# EAGLE schematic v1.9 (EAGLE 9.6.2)
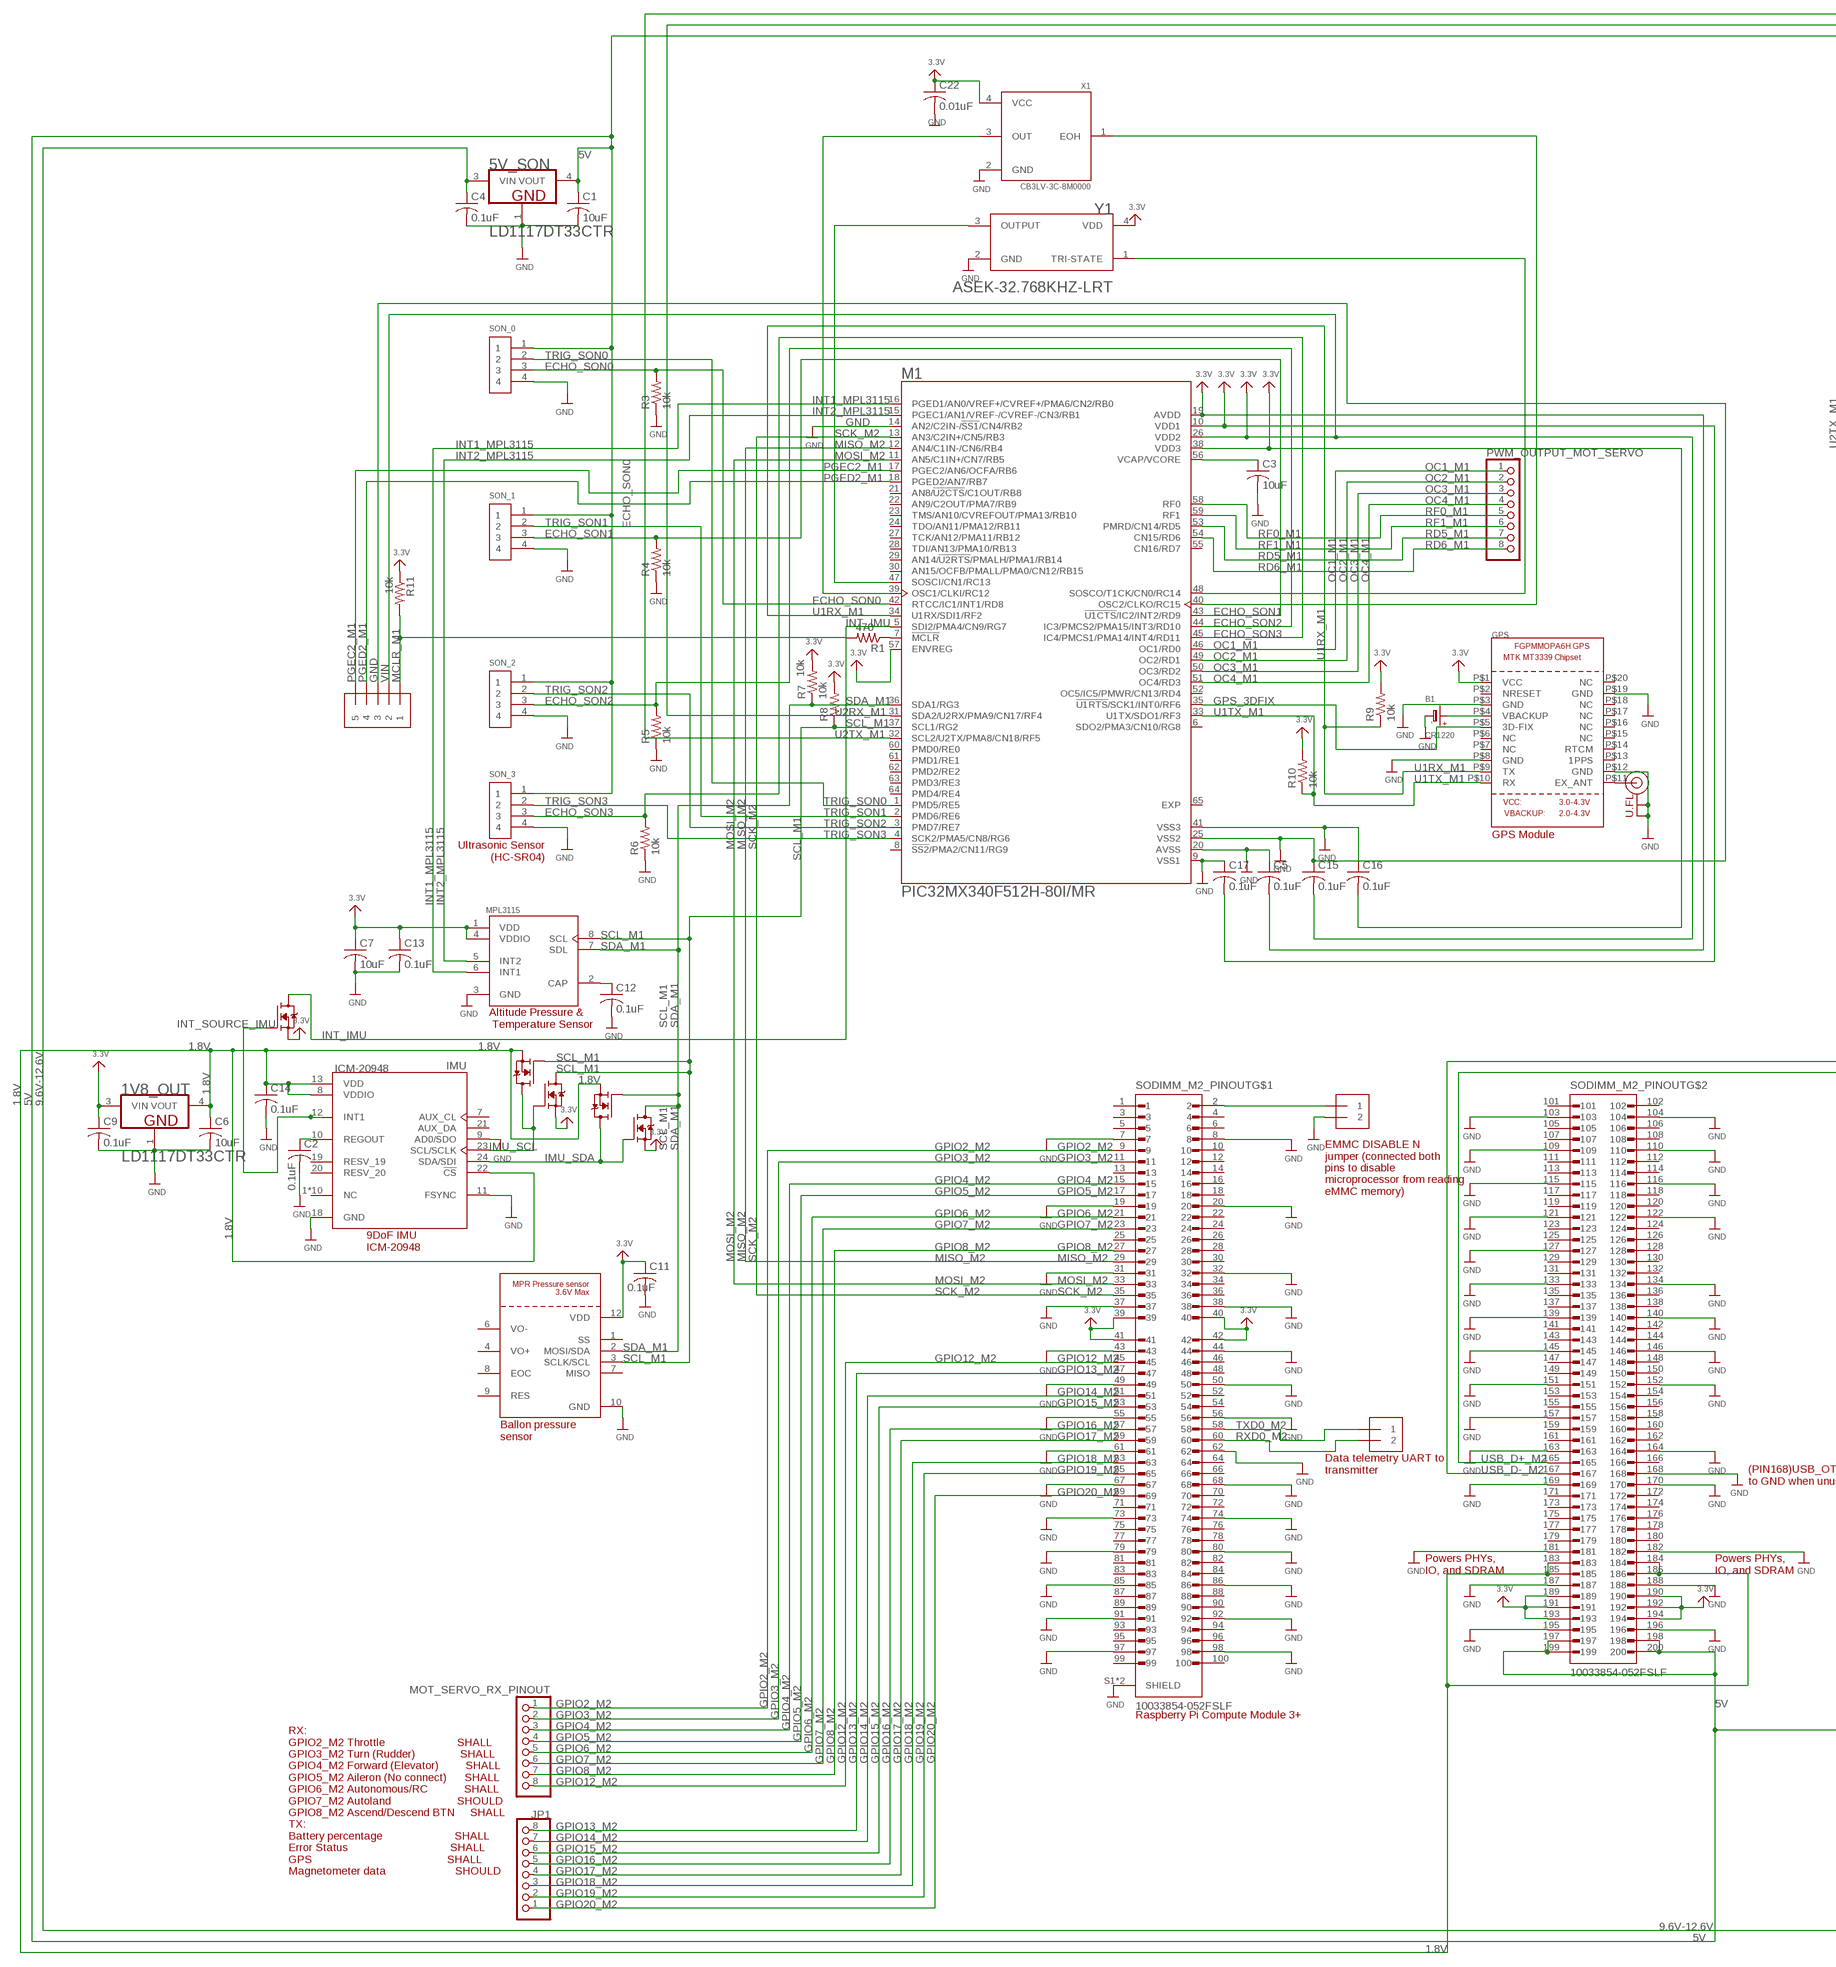
[diagram p0: schematic, sheet 1, part 1 of 2]
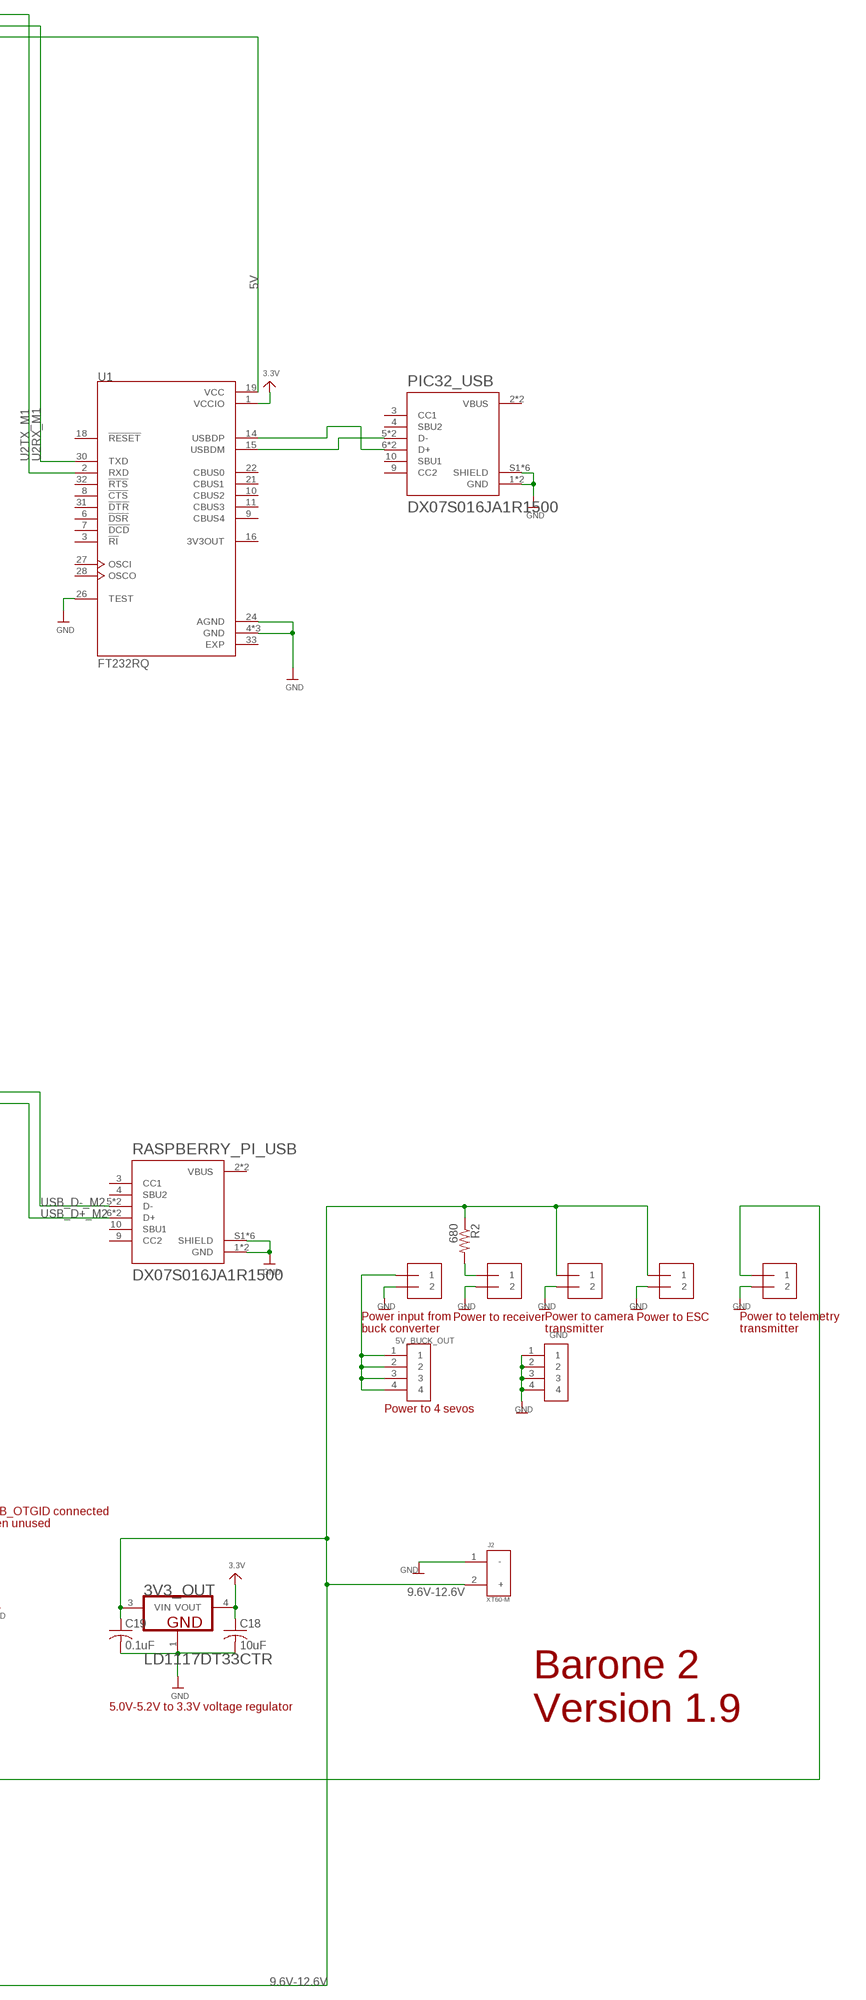
[diagram p1: schematic, sheet 1, part 2 of 2]

## Parts
1V8_OUT  STMICROELECTRONICS_LD1117DT33CTRSTMICROELECTRONICS_LD1117DT33CTR_0_2  [STMICROELECTRONICS_LD1117DT33CTR_2]
3V3_OUT  STMICROELECTRONICS_LD1117DT33CTRSTMICROELECTRONICS_LD1117DT33CTR_0_2  [STMICROELECTRONICS_LD1117DT33CTR_2]
5V_BUCK_IN  1X2-3.5MM  [1X2-3.5MM]
5V_BUCK_OUT  1X4-BIG  [1X04-BIG]
5V_SON  STMICROELECTRONICS_LD1117DT33CTRSTMICROELECTRONICS_LD1117DT50CTR_0_2  STMICROELECTRONICS_LD1117DT33CTRSTMICROELECTRONICS_LD1117DT33CTR_0_2  [STMICROELECTRONICS_LD1117DT33CTR_2]
B1  CR1220  BATTERYCR1220_SMT  [CR1220]
C1  10uF  C-USC0805  [C0805]
C2  0.1uF  C-USC0805  [C0805]
C3  10uF  C-USC0805  [C0805]
C4  0.1uF  C-USC0805  [C0805]
C5  0.1uF  C-USC0805  [C0805]
C6  10uF  C-USC0805  [C0805]
C7  10uF  C-USC0805  [C0805]
C9  0.1uF  C-USC0805  [C0805]
C11  0.1uF  C-USC0805  [C0805]
C12  0.1uF  C-USC0805  [C0805]
C13  0.1uF  C-USC0805  [C0805]
C14  0.1uF  C-USC0805  [C0805]
C15  0.1uF  C-USC0805  [C0805]
C16  0.1uF  C-USC0805  [C0805]
C17  0.1uF  C-USC0805  [C0805]
C18  10uF  C-USC0805  [C0805]
C19  0.1uF  C-USC0805  [C0805]
C22  0.01uF  C-USC0805  [C0805]
CAMERA_POWER  1X2-3.5MM  [1X2-3.5MM]
EMMC_DISABLE_N  1X2-3.5MM  [1X2-3.5MM]
ESC_POWER  1X2-3.5MM  [1X2-3.5MM]
GND  1X4-BIG  [1X04-BIG]
GPS  GPS_FGPMMOPA6H  [FGPMMOPA6H]
ICSP  1X5  [1X05-3.5MM]
IMU  ICM-20948  [QFN40P300X300X105-24N]
INT_LLC_IMU  BSS138  [SOT95P240X111-3N]
J2  XT60-M  [AMASS_XT60-M]
JP1  PINHD-1X8CLEANBIG  [1X08-CLEANBIG]
M1  PIC32MX340F512H-80I/MR  [QFN50P900X900X100-65N]
MOT_SERVO_RX_PINOUT  PINHD-1X8CLEANBIG  [1X08-CLEANBIG]
MPL3115  MPL3115A2  [PSON125P300X500X120-8N]
MPR  MPR_SERIES_I2C_PRESSURE  [MPR_SERIES_I2C_PRESSURE]
PIC32_USB  DX07S016JA1R1500  [JAE_DX07S016JA1R1500]
PWM_OUTPUT_MOT_SERVO  PINHD-1X8CLEANBIG  [1X08-CLEANBIG]
R1  470  R-US_R0805W  [R0805W]
R2  680  R-US_R0805W  [R0805W]
R3  10k  R-US_R0805W  [R0805W]
R4  10k  R-US_R0805W  [R0805W]
R5  10k  R-US_R0805W  [R0805W]
R6  10k  R-US_R0805W  [R0805W]
R7  10k  R-US_R0805W  [R0805W]
R8  10k  R-US_R0805W  [R0805W]
R9  10k  R-US_R0805W  [R0805W]
R10  10k  R-US_R0805W  [R0805W]
R11  10k  R-US_R0805W  [R0805W]
RASPBERRY_PI_USB  DX07S016JA1R1500  [JAE_DX07S016JA1R1500]
RC_RECEIVER_POWER  1X2-3.5MM  [1X2-3.5MM]
SCL_IN_IMU  BSS138  [SOT95P240X111-3N]
SCL_OUT_IMU  BSS138  [SOT95P240X111-3N]
SDA_IN_IMU1  BSS138  [SOT95P240X111-3N]
SDA_OUT_IMU  BSS138  [SOT95P240X111-3N]
SODIMM_M2_PINOUT  10033854-052FSLF  [AMPHENOL_10033854-052FSLF]
SON_0  1X4-BIG  [1X04-BIG]
SON_1  1X4-BIG  [1X04-BIG]
SON_2  1X4-BIG  [1X04-BIG]
SON_3  1X4-BIG  [1X04-BIG]
U1  FT232RQ  [QFN50P500X500X90-33N]
U.FL  U.FL  [U.FL]
UART_M2  1X2-3.5MM  [1X2-3.5MM]
UART_M2_TX_POWER  1X2-3.5MM  [1X2-3.5MM]
X1  CB3LV-3C-8M0000  CB3LV-3C-20M0000  [OSCCC700X500X180-4N]
Y1  ABRACON_ASEK-32_768KHZ-LRTABRACON_ASEK-32_768KHZ-LRT_0_0  [ABRACON_ASEK-32_768KHZ-LRT_0]

## Nets
1.8V: 1V8_OUT.4(VOUT) C6.1 C14.1 IMU.8(VDDIO) IMU.13(VDD) IMU.22(!CS) SCL_IN_IMU.2(S) SDA_OUT_IMU.2(S) SODIMM_M2_PINOUT.183 SODIMM_M2_PINOUT.184 SODIMM_M2_PINOUT.185 SODIMM_M2_PINOUT.186
5V: 5V_SON.4(VOUT) C1.1 SODIMM_M2_PINOUT.197 SODIMM_M2_PINOUT.198 SODIMM_M2_PINOUT.199 SODIMM_M2_PINOUT.200 SON_0.1 SON_1.1 SON_2.1 SON_3.1 U1.19(VCC) UART_M2_TX_POWER.1
9.6V-12.6V: 3V3_OUT.3(VIN) 5V_SON.3(VIN) C4.1 C19.1 CAMERA_POWER.1 ESC_POWER.1 J2.2(+) R2.1
ECHO_SON0: M1.42(RTCC/IC1/INT1/RD8) R3.2 SON_0.3
ECHO_SON1: M1.43(!U1CTS!/IC2/INT2/RD9) R4.2 SON_1.3
ECHO_SON2: M1.44(IC3/PMCS2/PMA15/INT3/RD10) R5.2 SON_2.3
ECHO_SON3: M1.45(IC4/PMCS1/PMA14/INT4/RD11) R6.2 SON_3.3
GND: 1V8_OUT.1(GND) 3V3_OUT.1(GND) 5V_BUCK_IN.2 5V_SON.1(GND) B1.- C1.2 C2.2 C3.2 C4.2 C5.1 C6.2 C7.2 C9.2 C11.2 C12.2 C13.2 C14.2 C15.1 C16.1 C17.1 C18.2 C19.2 C22.2 CAMERA_POWER.2 EMMC_DISABLE_N.2 ESC_POWER.2 GND.1 GND.2 GND.3 GND.4 GPS.P$3(GND) GPS.P$8(GND) GPS.P$19(GND) ICSP.3 IMU.9(AD0/SDO) IMU.11(FSYNC) IMU.18(GND) J2.1(-) M1.9(VSS1) M1.14(AN2/C2IN-/!SS1!/CN4/RB2) M1.20(AVSS) M1.25(VSS2) M1.41(VSS3) MPL3115.3(GND) MPR.10(GND) PIC32_USB.1(GND) PIC32_USB.12(GND) PIC32_USB.S1(SHIELD) PIC32_USB.S2(SHIELD) PIC32_USB.S3(SHIELD) PIC32_USB.S4(SHIELD) PIC32_USB.S5(SHIELD) PIC32_USB.S6(SHIELD) R3.1 R4.1 R5.1 R6.1 RASPBERRY_PI_USB.1(GND) RASPBERRY_PI_USB.12(GND) RASPBERRY_PI_USB.S1(SHIELD) RASPBERRY_PI_USB.S2(SHIELD) RASPBERRY_PI_USB.S3(SHIELD) RASPBERRY_PI_USB.S4(SHIELD) RASPBERRY_PI_USB.S5(SHIELD) RASPBERRY_PI_USB.S6(SHIELD) RC_RECEIVER_POWER.2 SODIMM_M2_PINOUT.7 SODIMM_M2_PINOUT.8 SODIMM_M2_PINOUT.19 SODIMM_M2_PINOUT.20 SODIMM_M2_PINOUT.31 SODIMM_M2_PINOUT.32 SODIMM_M2_PINOUT.37 SODIMM_M2_PINOUT.38 SODIMM_M2_PINOUT.43 SODIMM_M2_PINOUT.44 SODIMM_M2_PINOUT.49 SODIMM_M2_PINOUT.50 SODIMM_M2_PINOUT.55 SODIMM_M2_PINOUT.56 SODIMM_M2_PINOUT.61 SODIMM_M2_PINOUT.62 SODIMM_M2_PINOUT.67 SODIMM_M2_PINOUT.68 SODIMM_M2_PINOUT.73 SODIMM_M2_PINOUT.74 SODIMM_M2_PINOUT.79 SODIMM_M2_PINOUT.80 SODIMM_M2_PINOUT.85 SODIMM_M2_PINOUT.86 SODIMM_M2_PINOUT.91 SODIMM_M2_PINOUT.92 SODIMM_M2_PINOUT.97 SODIMM_M2_PINOUT.98 SODIMM_M2_PINOUT.103 SODIMM_M2_PINOUT.104 SODIMM_M2_PINOUT.109 SODIMM_M2_PINOUT.110 SODIMM_M2_PINOUT.115 SODIMM_M2_PINOUT.116 SODIMM_M2_PINOUT.121 SODIMM_M2_PINOUT.122 SODIMM_M2_PINOUT.127 SODIMM_M2_PINOUT.133 SODIMM_M2_PINOUT.134 SODIMM_M2_PINOUT.139 SODIMM_M2_PINOUT.140 SODIMM_M2_PINOUT.145 SODIMM_M2_PINOUT.146 SODIMM_M2_PINOUT.151 SODIMM_M2_PINOUT.152 SODIMM_M2_PINOUT.157 SODIMM_M2_PINOUT.163 SODIMM_M2_PINOUT.164 SODIMM_M2_PINOUT.168 SODIMM_M2_PINOUT.169 SODIMM_M2_PINOUT.170 SODIMM_M2_PINOUT.181 SODIMM_M2_PINOUT.182 SODIMM_M2_PINOUT.187 SODIMM_M2_PINOUT.188 SODIMM_M2_PINOUT.195 SODIMM_M2_PINOUT.196 SODIMM_M2_PINOUT.S1(SHIELD) SODIMM_M2_PINOUT.S2(SHIELD) SON_0.4 SON_1.4 SON_2.4 SON_3.4 U1.4(GND) U1.17(GND) U1.20(GND) U1.24(AGND) U1.26(TEST) UART_M2_TX_POWER.2 X1.2(GND) Y1.2(GND)
GPIO2_M2: MOT_SERVO_RX_PINOUT.1 SODIMM_M2_PINOUT.9
GPIO3_M2: MOT_SERVO_RX_PINOUT.2 SODIMM_M2_PINOUT.11
GPIO4_M2: MOT_SERVO_RX_PINOUT.3 SODIMM_M2_PINOUT.15
GPIO5_M2: MOT_SERVO_RX_PINOUT.4 SODIMM_M2_PINOUT.17
GPIO6_M2: MOT_SERVO_RX_PINOUT.5 SODIMM_M2_PINOUT.21
GPIO7_M2: MOT_SERVO_RX_PINOUT.6 SODIMM_M2_PINOUT.23
GPIO8_M2: MOT_SERVO_RX_PINOUT.7 SODIMM_M2_PINOUT.27
GPIO12_M2: MOT_SERVO_RX_PINOUT.8 SODIMM_M2_PINOUT.45
GPIO13_M2: JP1.8 SODIMM_M2_PINOUT.47
GPIO14_M2: JP1.7 SODIMM_M2_PINOUT.51
GPIO15_M2: JP1.6 SODIMM_M2_PINOUT.53
GPIO16_M2: JP1.5 SODIMM_M2_PINOUT.57
GPIO17_M2: JP1.4 SODIMM_M2_PINOUT.59
GPIO18_M2: JP1.3 SODIMM_M2_PINOUT.63
GPIO19_M2: JP1.2 SODIMM_M2_PINOUT.65
GPIO20_M2: JP1.1 SODIMM_M2_PINOUT.69
GPS_3DFIX: GPS.P$5(3D-FIX) M1.35(!U1RTS!/SCK1/INT0/RF6)
IMU_SCL: IMU.23(SCL/SCLK) SCL_IN_IMU.3(D) SCL_OUT_IMU.1(G)
IMU_SDA: IMU.24(SDA/SDI) SDA_IN_IMU1.1(G) SDA_OUT_IMU.3(D)
INT1_MPL3115: M1.16(PGED1/AN0/VREF+/CVREF+/PMA6/CN2/RB0) MPL3115.6(INT1)
INT2_MPL3115: M1.15(PGEC1/AN1/VREF-/CVREF-/CN3/RB1) MPL3115.5(INT2)
INT_IMU: INT_LLC_IMU.3(D) M1.5(SDI2/PMA4/CN9/RG7)
INT_SOURCE_IMU: IMU.12(INT1) INT_LLC_IMU.1(G)
MCLR_M1: ICSP.1 R1.2 R11.2
MISO_M2: M1.12(AN4/C1IN-/CN6/RB4) SODIMM_M2_PINOUT.29
MOSI_M2: M1.11(AN5/C1IN+/CN7/RB5) SODIMM_M2_PINOUT.33
N$2: GPS.P$12(GND) U.FL.P$1(GND) U.FL.P$2(GND) ; supply symbol labelled GND
N$3: GPS.P$11(EX_ANT) U.FL.P$3(SIGNAL)
N$4: EMMC_DISABLE_N.1 SODIMM_M2_PINOUT.2
N$5: 5V_BUCK_IN.1 5V_BUCK_OUT.1 5V_BUCK_OUT.2 5V_BUCK_OUT.3 5V_BUCK_OUT.4
N$6: M1.40(OSC2/CLKO/RC15) X1.1(EOH)
N$7: M1.39(OSC1/CLKI/RC12) X1.3(OUT)
N$8: M1.48(SOSCO/T1CK/CN0/RC14) Y1.1(TRI-STATE)
N$9: M1.47(SOSCI/CN1/RC13) Y1.3(OUTPUT)
N$10: C12.1 MPL3115.2(CAP)
N$13: M1.7(!MCLR) R1.1
N$14: R2.2 RC_RECEIVER_POWER.1
N$15: PIC32_USB.5(D-) PIC32_USB.8(D-) U1.15(USBDM)
N$16: PIC32_USB.6(D+) PIC32_USB.7(D+) U1.14(USBDP)
N$21: B1.+$1(+) B1.+$2(+) GPS.P$4(VBACKUP)
N$32: C2.1 IMU.10(REGOUT)
OC1_M1: M1.46(OC1/RD0) PWM_OUTPUT_MOT_SERVO.1
OC2_M1: M1.49(OC2/RD1) PWM_OUTPUT_MOT_SERVO.2
OC3_M1: M1.50(OC3/RD2) PWM_OUTPUT_MOT_SERVO.3
OC4_M1: M1.51(OC4/RD3) PWM_OUTPUT_MOT_SERVO.4
PGEC2_M1: ICSP.5 M1.17(PGEC2/AN6/OCFA/RB6)
PGED2_M1: ICSP.4 M1.18(PGED2/AN7/RB7)
RD5_M1: M1.53(PMRD/CN14/RD5) PWM_OUTPUT_MOT_SERVO.7
RD6_M1: M1.54(CN15/RD6) PWM_OUTPUT_MOT_SERVO.8
RF0_M1: M1.58(RF0) PWM_OUTPUT_MOT_SERVO.5
RF1_M1: M1.59(RF1) PWM_OUTPUT_MOT_SERVO.6
RXD0_M2: SODIMM_M2_PINOUT.60 UART_M2.2
SCK_M2: M1.13(AN3/C2IN+/CN5/RB3) SODIMM_M2_PINOUT.35
SCL_M1: M1.37(SCL1/RG2) MPL3115.8(SCL) MPR.3(SCLK/SCL) R8.1 SCL_IN_IMU.1(G) SCL_OUT_IMU.3(D)
SDA_M1: M1.36(SDA1/RG3) MPL3115.7(SDL) MPR.2(MOSI/SDA) R7.1 SDA_IN_IMU1.3(D) SDA_OUT_IMU.1(G)
TRIG_SON0: M1.1(PMD5/RE5) SON_0.2
TRIG_SON1: M1.2(PMD6/RE6) SON_1.2
TRIG_SON2: M1.3(PMD7/RE7) SON_2.2
TRIG_SON3: M1.4(SCK2/PMA5/CN8/RG6) SON_3.2
TXD0_M2: SODIMM_M2_PINOUT.58 UART_M2.1
U1RX_M1: GPS.P$9(TX) M1.34(U1RX/SDI1/RF2) R9.1
U1TX_M1: GPS.P$10(RX) M1.33(U1TX/SDO1/RF3) R10.1
U2RX_M1: M1.31(SDA2/U2RX/PMA9/CN17/RF4) U1.30(TXD)
U2TX_M1: M1.32(SCL2/U2TX/PMA8/CN18/RF5) U1.2(RXD)
USB_D+_M2: RASPBERRY_PI_USB.6(D+) RASPBERRY_PI_USB.7(D+) SODIMM_M2_PINOUT.165
USB_D-_M2: RASPBERRY_PI_USB.5(D-) RASPBERRY_PI_USB.8(D-) SODIMM_M2_PINOUT.167
VCAP_VCORE_M1: C3.1 M1.56(VCAP/VCORE)
VIN: 1V8_OUT.3(VIN) 3V3_OUT.4(VOUT) C5.2 C7.1 C9.1 C11.1 C13.1 C15.2 C16.2 C17.2 C18.1 C22.1 GPS.P$1(VCC) ICSP.2 INT_LLC_IMU.2(S) M1.10(VDD1) M1.19(AVDD) M1.26(VDD2) M1.38(VDD3) M1.57(ENVREG) MPL3115.1(VDD) MPL3115.4(VDDIO) MPR.12(VDD) R7.2 R8.2 R9.2 R10.2 R11.1 SCL_OUT_IMU.2(S) SDA_IN_IMU1.2(S) SODIMM_M2_PINOUT.39 SODIMM_M2_PINOUT.40 SODIMM_M2_PINOUT.41 SODIMM_M2_PINOUT.42 SODIMM_M2_PINOUT.189 SODIMM_M2_PINOUT.190 SODIMM_M2_PINOUT.191 SODIMM_M2_PINOUT.192 SODIMM_M2_PINOUT.193 SODIMM_M2_PINOUT.194 U1.1(VCCIO) X1.4(VCC) Y1.4(VDD) ; supply symbol labelled 3.3V
Unconnected: GPS.P$2(NRESET) GPS.P$6(NC) GPS.P$7(NC) GPS.P$13(1PPS) GPS.P$14(RTCM) GPS.P$15(NC) GPS.P$16(NC) GPS.P$17(NC) GPS.P$18(NC) GPS.P$20(NC) IMU.1(NC) IMU.2(NC) IMU.3(NC) IMU.4(NC) IMU.5(NC) IMU.6(NC) IMU.7(AUX_CL) IMU.14(NC) IMU.15(NC) IMU.16(NC) IMU.17(NC) IMU.19(RESV_19) IMU.20(RESV_20) IMU.21(AUX_DA) M1.6(SDO2/PMA3/CN10/RG8) M1.8(!SS2!/PMA2/CN11/RG9) M1.21(AN8/!U2CTS!/C1OUT/RB8) M1.22(AN9/C2OUT/PMA7/RB9) M1.23(TMS/AN10/CVREFOUT/PMA13/RB10) M1.24(TDO/AN11/PMA12/RB11) M1.27(TCK/AN12/PMA11/RB12) M1.28(TDI/AN13/PMA10/RB13) M1.29(AN14/!U2RTS!/PMALH/PMA1/RB14) M1.30(AN15/OCFB/PMALL/PMA0/CN12/RB15) M1.52(OC5/IC5/PMWR/CN13/RD4) M1.55(CN16/RD7) M1.60(PMD0/RE0) M1.61(PMD1/RE1) M1.62(PMD2/RE2) M1.63(PMD3/RE3) M1.64(PMD4/RE4) MPR.1(SS) MPR.4(VO+) MPR.6(VO-) MPR.7(MISO) MPR.8(EOC) MPR.9(RES) PIC32_USB.3(CC1) PIC32_USB.4(SBU2) PIC32_USB.9(CC2) PIC32_USB.10(SBU1) RASPBERRY_PI_USB.3(CC1) RASPBERRY_PI_USB.4(SBU2) RASPBERRY_PI_USB.9(CC2) RASPBERRY_PI_USB.10(SBU1) SODIMM_M2_PINOUT.1 SODIMM_M2_PINOUT.3 SODIMM_M2_PINOUT.4 SODIMM_M2_PINOUT.5 SODIMM_M2_PINOUT.6 SODIMM_M2_PINOUT.10 SODIMM_M2_PINOUT.12 SODIMM_M2_PINOUT.13 SODIMM_M2_PINOUT.14 SODIMM_M2_PINOUT.16 SODIMM_M2_PINOUT.18 SODIMM_M2_PINOUT.22 SODIMM_M2_PINOUT.24 SODIMM_M2_PINOUT.25 SODIMM_M2_PINOUT.26 SODIMM_M2_PINOUT.28 SODIMM_M2_PINOUT.30 SODIMM_M2_PINOUT.34 SODIMM_M2_PINOUT.36 SODIMM_M2_PINOUT.46 SODIMM_M2_PINOUT.48 SODIMM_M2_PINOUT.52 SODIMM_M2_PINOUT.54 SODIMM_M2_PINOUT.64 SODIMM_M2_PINOUT.66 SODIMM_M2_PINOUT.70 SODIMM_M2_PINOUT.71 SODIMM_M2_PINOUT.72 SODIMM_M2_PINOUT.75 SODIMM_M2_PINOUT.76 SODIMM_M2_PINOUT.77 SODIMM_M2_PINOUT.78 SODIMM_M2_PINOUT.81 SODIMM_M2_PINOUT.82 SODIMM_M2_PINOUT.83 SODIMM_M2_PINOUT.84 SODIMM_M2_PINOUT.87 SODIMM_M2_PINOUT.88 SODIMM_M2_PINOUT.89 SODIMM_M2_PINOUT.90 SODIMM_M2_PINOUT.93 SODIMM_M2_PINOUT.94 SODIMM_M2_PINOUT.95 SODIMM_M2_PINOUT.96 SODIMM_M2_PINOUT.99 SODIMM_M2_PINOUT.100 SODIMM_M2_PINOUT.101 SODIMM_M2_PINOUT.102 SODIMM_M2_PINOUT.105 SODIMM_M2_PINOUT.106 SODIMM_M2_PINOUT.107 SODIMM_M2_PINOUT.108 SODIMM_M2_PINOUT.111 SODIMM_M2_PINOUT.112 SODIMM_M2_PINOUT.113 SODIMM_M2_PINOUT.114 SODIMM_M2_PINOUT.117 SODIMM_M2_PINOUT.118 SODIMM_M2_PINOUT.119 SODIMM_M2_PINOUT.120 SODIMM_M2_PINOUT.123 SODIMM_M2_PINOUT.124 SODIMM_M2_PINOUT.125 SODIMM_M2_PINOUT.126 SODIMM_M2_PINOUT.128 SODIMM_M2_PINOUT.129 SODIMM_M2_PINOUT.130 SODIMM_M2_PINOUT.131 SODIMM_M2_PINOUT.132 SODIMM_M2_PINOUT.135 SODIMM_M2_PINOUT.136 SODIMM_M2_PINOUT.137 SODIMM_M2_PINOUT.138 SODIMM_M2_PINOUT.141 SODIMM_M2_PINOUT.142 SODIMM_M2_PINOUT.143 SODIMM_M2_PINOUT.144 SODIMM_M2_PINOUT.147 SODIMM_M2_PINOUT.148 SODIMM_M2_PINOUT.149 SODIMM_M2_PINOUT.150 SODIMM_M2_PINOUT.153 SODIMM_M2_PINOUT.154 SODIMM_M2_PINOUT.155 SODIMM_M2_PINOUT.156 SODIMM_M2_PINOUT.158 SODIMM_M2_PINOUT.159 SODIMM_M2_PINOUT.160 SODIMM_M2_PINOUT.161 SODIMM_M2_PINOUT.162 SODIMM_M2_PINOUT.166 SODIMM_M2_PINOUT.171 SODIMM_M2_PINOUT.172 SODIMM_M2_PINOUT.173 SODIMM_M2_PINOUT.174 SODIMM_M2_PINOUT.175 SODIMM_M2_PINOUT.176 SODIMM_M2_PINOUT.177 SODIMM_M2_PINOUT.178 SODIMM_M2_PINOUT.179 SODIMM_M2_PINOUT.180 U1.3(!RI) U1.6(!DSR) U1.7(!DCD) U1.8(!CTS) U1.9(CBUS4) U1.10(CBUS2) U1.11(CBUS3) U1.16(3V3OUT) U1.18(!RESET) U1.21(CBUS1) U1.22(CBUS0) U1.27(OSCI) U1.28(OSCO) U1.31(!DTR) U1.32(!RTS)

## Notes on the sheet
- U.FL
- GPS Module
- Ultrasonic Sensor
  (HC-SR04)
- Altitude Pressure &
   Temperature Sensor
- EMMC DISABLE N 
  jumper (connected both 
  pins to disable
  microprocessor from reading 
  eMMC memory)
- 9DoF IMU
  ICM-20948
- Power to receiver | Power to ESC
- Power input from
  buck converter
- Power to camera 
  transmitter
- Power to telemetry
  transmitter
- Power to 4 sevos
- Ballon pressure
  sensor
- Data telemetry UART to 
  transmitter
- (PIN168)USB_OTGID connected
  to GND when unused
- Powers PHYs, 
  IO, and SDRAM
- Powers PHYs, 
  IO, and SDRAM
- 5.0V-5.2V to 3.3V voltage regulator
- Barone 2
  Version 1.9
- Raspberry Pi Compute Module 3+
- RX:
  GPIO2_M2 Throttle                        SHALL
  GPIO3_M2 Turn (Rudder)               SHALL
  GPIO4_M2 Forward (Elevator)         SHALL
  GPIO5_M2 Aileron (No connect)      SHALL
  GPIO6_M2 Autonomous/RC            SHALL
  GPIO7_M2 Autoland                      SHOULD
  GPIO8_M2 Ascend/Descend BTN     SHALL
  TX:
  Battery percentage                        SHALL
  Error Status                                  SHALL
  GPS                                             SHALL
  Magnetometer data                       SHOULD

## Power pins joined to a net without a drawn wire
EXP: M1.65(EXP) U1.33(EXP)
VBUS: PIC32_USB.2(VBUS) PIC32_USB.11(VBUS) RASPBERRY_PI_USB.2(VBUS) RASPBERRY_PI_USB.11(VBUS)

## Library data of the parts
1V8_OUT 3V3_OUT 5V_SON = STMicroelectronics - LD1117DT33CTR:STMICROELECTRONICS_LD1117DT33CTR: PM-REG-LD1117-SOT3; CIIVA_IDS: 1248215; COMPONENT_LINK_1_DESCRIPTION: Manufacturer URL; COMPONENT_LINK_1_URL: http://www.st.com; DATASHEET: http://www.st.com/internet/com/TECHNICAL_RESOURCES/TECHNICAL_LITERATURE/DATASHEET/CD00000544.pdf; DATASHEET_VERSION: 1/11/2011; FOOTPRINT_VARIANT_NAME_0: Level C; FOOTPRINT_VARIANT_NAME_1: Level B; FOOTPRINT_VARIANT_NAME_2: Level A; IMPORTED: yes; IMPORTED_FROM: vault; IMPORT_TS: 1521847004; MF: STMicroelectronics; MPN: LD1117DT33CTR; PACKAGE: TO-252; PACKAGE_DESCRIPTION: 3-Pin Transistor Outline Package 2.28 mm Pitch, 9.7 mm Lead Span (DPAK); PACKAGE_VERSION: 2011; PREFIX: U; RELEASE_DATE: 1329863937; VAULT_GUID: 462C2B06-6F70-43B6-92C3-77C4630C8B91; VAULT_REVISION: 270E85B6-74D3-48C5-8A3F-D654AE466397
5V_BUCK_IN CAMERA_POWER EMMC_DISABLE_N ESC_POWER RC_RECEIVER_POWER UART_M2 UART_M2_TX_POWER = adafruit:1X2: 3.5mm Terminal block http://www.ladyada.net/library/pcb/eaglelibrary.html
5V_BUCK_OUT GND SON_1-SON_3 = adafruit:1X4: 4-pin connector
B1 = microbuilder:BATTERY: CR1220 SMT - Digikey: 3001K-ND CD2032 BAT-HLD-001 - Digikey: BAT-HLD-001-ND
C1-C7 C9 C11-C19 C22 = rcl:C-US: CAPACITOR, American symbol; SPICEPREFIX: C
GPS = adafruit:GPS_FGPMMOPA6H: GPS Module - MTK MT3339 Chipset, -165dBm sensitivity, 22 channels, 10Hz, auto-select external antenna options
ICSP = adafruit:1X5
IMU = ICM-20948:ICM-20948: Accelerometer, Gyroscope, Magnetometer, 9 Axis Sensor I²C, SPI Output Check prices <https://pricing.snapeda.com/parts/ICM-20948/TDK%20InvenSense/view-part?ref=eda>; AVAILABILITY: Good; DESCRIPTION: Accelerometer, Gyroscope, Magnetometer, 9 Axis Sensor I²C, SPI Output; MF: TDK InvenSense; MP: ICM-20948; PACKAGE: TFQFN-24 TDK InvenSense; PRICE: None; PURCHASE-URL: https://pricing.snapeda.com/search/part/ICM-20948/?ref=eda
INT_LLC_IMU SCL_IN_IMU SCL_OUT_IMU SDA_IN_IMU1 SDA_OUT_IMU = BSS138:BSS138: N-Channel 50V 220mA (Ta) 360mW (Ta) Surface Mount SOT-23-3 Check prices <https://pricing.snapeda.com/parts/BSS138/ON%20Semiconductor/view-part?ref=eda>; AVAILABILITY: Good; DESCRIPTION: N-Channel 50V 220mA (Ta) 360mW (Ta) Surface Mount SOT-23-3; MF: ON Semiconductor; MP: BSS138; PACKAGE: SOT-23 ON; PRICE: None; PURCHASE-URL: https://pricing.snapeda.com/search/part/BSS138/?ref=eda
J2 = XT60-M:XT60-M: DC supply; XT60; male; PIN:2; for cable; soldered; 60A; 500V; AVAILABILITY: Unavailable; DESCRIPTION: Plug; DC supply; XT60; male; PIN: 2; for cable; soldered; 30A; 500V; MF: AMASS; MP: XT60-M; PACKAGE: Package; PRICE: None
JP1 MOT_SERVO_RX_PINOUT PWM_OUTPUT_MOT_SERVO = adafruit:PINHD-1X8: PIN HEADER
M1 = PIC32MX340F512H-80I_MR:PIC32MX340F512H-80I/MR: PIC32 Series 32 kB RAM 512 kB Flash 32-Bit Microcontroller - QFN-64 Check prices <https://pricing.snapeda.com/parts/PIC32MX340F512H-80I/MR/Microchip/view-part?ref=eda>; AVAILABILITY: Warning; DESCRIPTION: MIPS32® M4K™ PIC® 32MX Microcontroller IC 32-Bit 80MHz 512KB (512K x 8) FLASH 64-VQFN (9x9); MF: Microchip; MP: PIC32MX340F512H-80I/MR; PACKAGE: QFN-64 Microchip; PRICE: None; PURCHASE-URL: https://pricing.snapeda.com/search/part/PIC32MX340F512H-80I/MR/?ref=eda
MPL3115 = MPL3115A2:MPL3115A2: Pressure Sensor, 50-110kpa, Lga-8 Check prices <https://pricing.snapeda.com/parts/MPL3115A2/NXP%20Semiconductors/view-part?ref=eda>; AVAILABILITY: Good; DESCRIPTION: Pressure Sensor 7.25PSI ~ 15.95PSI (50kPa ~ 110kPa) Absolute 24 b 8-TLGA; MF: NXP Semiconductors; MP: MPL3115A2; PACKAGE: TLGA-8 NXP Semiconductors; PRICE: None; PURCHASE-URL: https://pricing.snapeda.com/search/part/MPL3115A2/?ref=eda
MPR = microbuilder:MPR_SERIES_I2C_PRESSURE: I2C piezoresistive silicon pressure sensor
PIC32_USB RASPBERRY_PI_USB = DX07S016JA1R1500:DX07S016JA1R1500: USB-C (USB TYPE-C) USB 2.0 Receptacle Connector 24 (16+8 Dummy) Position Surface Mount, Right Angle; Through Hole Check prices <https://pricing.snapeda.com/parts/DX07S016JA1R1500/JAE%20Electronics/view-part?ref=eda>; AVAILABILITY: Warning; DESCRIPTION: USB-C (USB TYPE-C) USB 2.0 Receptacle Connector 24 (16+8 Dummy) Position Surface Mount, Right Angle; Through Hole; MF: JAE Electronics; MP: DX07S016JA1R1500; PACKAGE: None; PRICE: None; PURCHASE-URL: https://pricing.snapeda.com/search/part/DX07S016JA1R1500/?ref=eda
R1-R11 = adafruit:R-US_: RESISTOR, American symbol
SODIMM_M2_PINOUT = 10033854-052FSLF:10033854-052FSLF: 200 Position SODIMM DDR2 SDRAM Socket Surface Mount, 30grades Angle; DESCRIPTION: 200 Position SODIMM DDR2 SDRAM Socket Surface Mount; DIGI-KEY_PART_NUMBER: 609-1008-ND; MF: Amphenol ICC (FCI); MP: 10033854-052FSLF; PACKAGE: None; PURCHASE-URL: https://pricing.snapeda.com/search/part/10033854-052FSLF/?ref=eda; SPICEPREFIX: J
SON_0 = adafruit:1X4: 4-pin connector; SPICEPREFIX: X
U1 = FT232RQ:FT232RQ: USB-to-UART 1-CH 256Byte FIFO 5V 32-Pin QFN EP; AVAILABILITY: Unavailable; DESCRIPTION: USB Bridge, USB to UART USB 2.0 UART Interface 32-QFN (5x5); MF: FTDI, Future; MP: FT232RQ; PACKAGE: VFQFN-32 FTDI, Future; PRICE: None
U.FL = microbuilder:U.FL: U.FL Antenna Connector
X1 = CB3LV-3C-20M0000:CB3LV-3C-20M0000: Oscillator XO 50MHz 50ppm 50pF HCMOS/TTL 55% 3.3V 4-Pin SMD T/R Check prices <https://pricing.snapeda.com/parts/CB3LV-3C-20M0000/CTS-Frequency/view-part?ref=eda>; AVAILABILITY: Good; DESCRIPTION: 20MHz XO (Standard) HCMOS, TTL Oscillator 3.3V Enable/Disable 4-SMD, No Lead; MF: CTS-Frequency; MP: CB3LV-3C-20M0000; PACKAGE: SMD-4 CTS Electronic Components; PRICE: None; PURCHASE-URL: https://pricing.snapeda.com/search/part/CB3LV-3C-20M0000/?ref=eda
Y1 = Abracon - ASEK-32.768KHZ-LRT:ABRACON_ASEK-32_768KHZ-LRT: OSC XO 32.768KHZ CMOS SMD; AUTOMOTIVE: No; CENTROID_NOT_SPECIFIED: No; DATASHEET: https://abracon.com/Oscillators/ASEK.pdf; DEVICE_CLASS_L1: Passive Components; DEVICE_CLASS_L2: Crystals / Oscillators; DEVICE_CLASS_L3: Crystals; DIGIKEY_DESCRIPTION: XTAL OSC XO 32.7680KHZ CMOS SMD; DIGIKEY_PART_NUMBER: 535-9998-1-ND; FOOTPRINT_VARIANT_NAME_0: Recommended_Land_Pattern; FREQUENCY: 32.768kHz; HEIGHT: 1.2mm; LEAD_FREE: Yes; LOAD_CAPACITANCE: 15pF; MF: Abracon; MFG_PACKAGE_IDENT: ASEK; MFG_PACKAGE_IDENT_COMPONENT_ID: ea0871bcdd6e8f41; MFG_PACKAGE_IDENT_DATE: 0; MFG_PACKAGE_IDENT_REV: 0; MOUSER_DESCRIPTION: Standard Clock Oscillators 32.768KHz 3.3V -40C +85C 25ppm; MOUSER_PART_NUMBER: 815-ASEK-32.7K-LRT; MPN: ASEK-32.768KHZ-LRT; PACKAGE: SMT_CRYSTAL_3MM3_2MM6; PREFIX: Y; ROHS: Yes; SERIES: ASEK; STABILITY: 25ppm; TEMPERATURE_RANGE_HIGH: +85°C; TEMPERATURE_RANGE_LOW: -40°C; VERIFICATION_VERSION: 0.0.0.3